# Altium schematic sheet RTM_CON.SchDoc: AMC FMC Carrier v4
size 420 x 297 mm; CompanyName: WUT; Organization: WUT ISE; Address1: Warsaw University of Technology; Address2: Nowowiejska 15/19 00-665 Warsaw; Address3: t.przywozki@gmail.com; Revision: 1; SheetNumber: 20; SheetTotal: 29; Project: AMC FMC Carrier v4.0.2; ModifiedBy: F. Świtakowski; CheckedDate: -; Title2: RTM Connector; DivGrp: ISE; Designer: T. Przywozki; ModifiedDate: -; ProjectName: ADC/DAC MEZZANINE
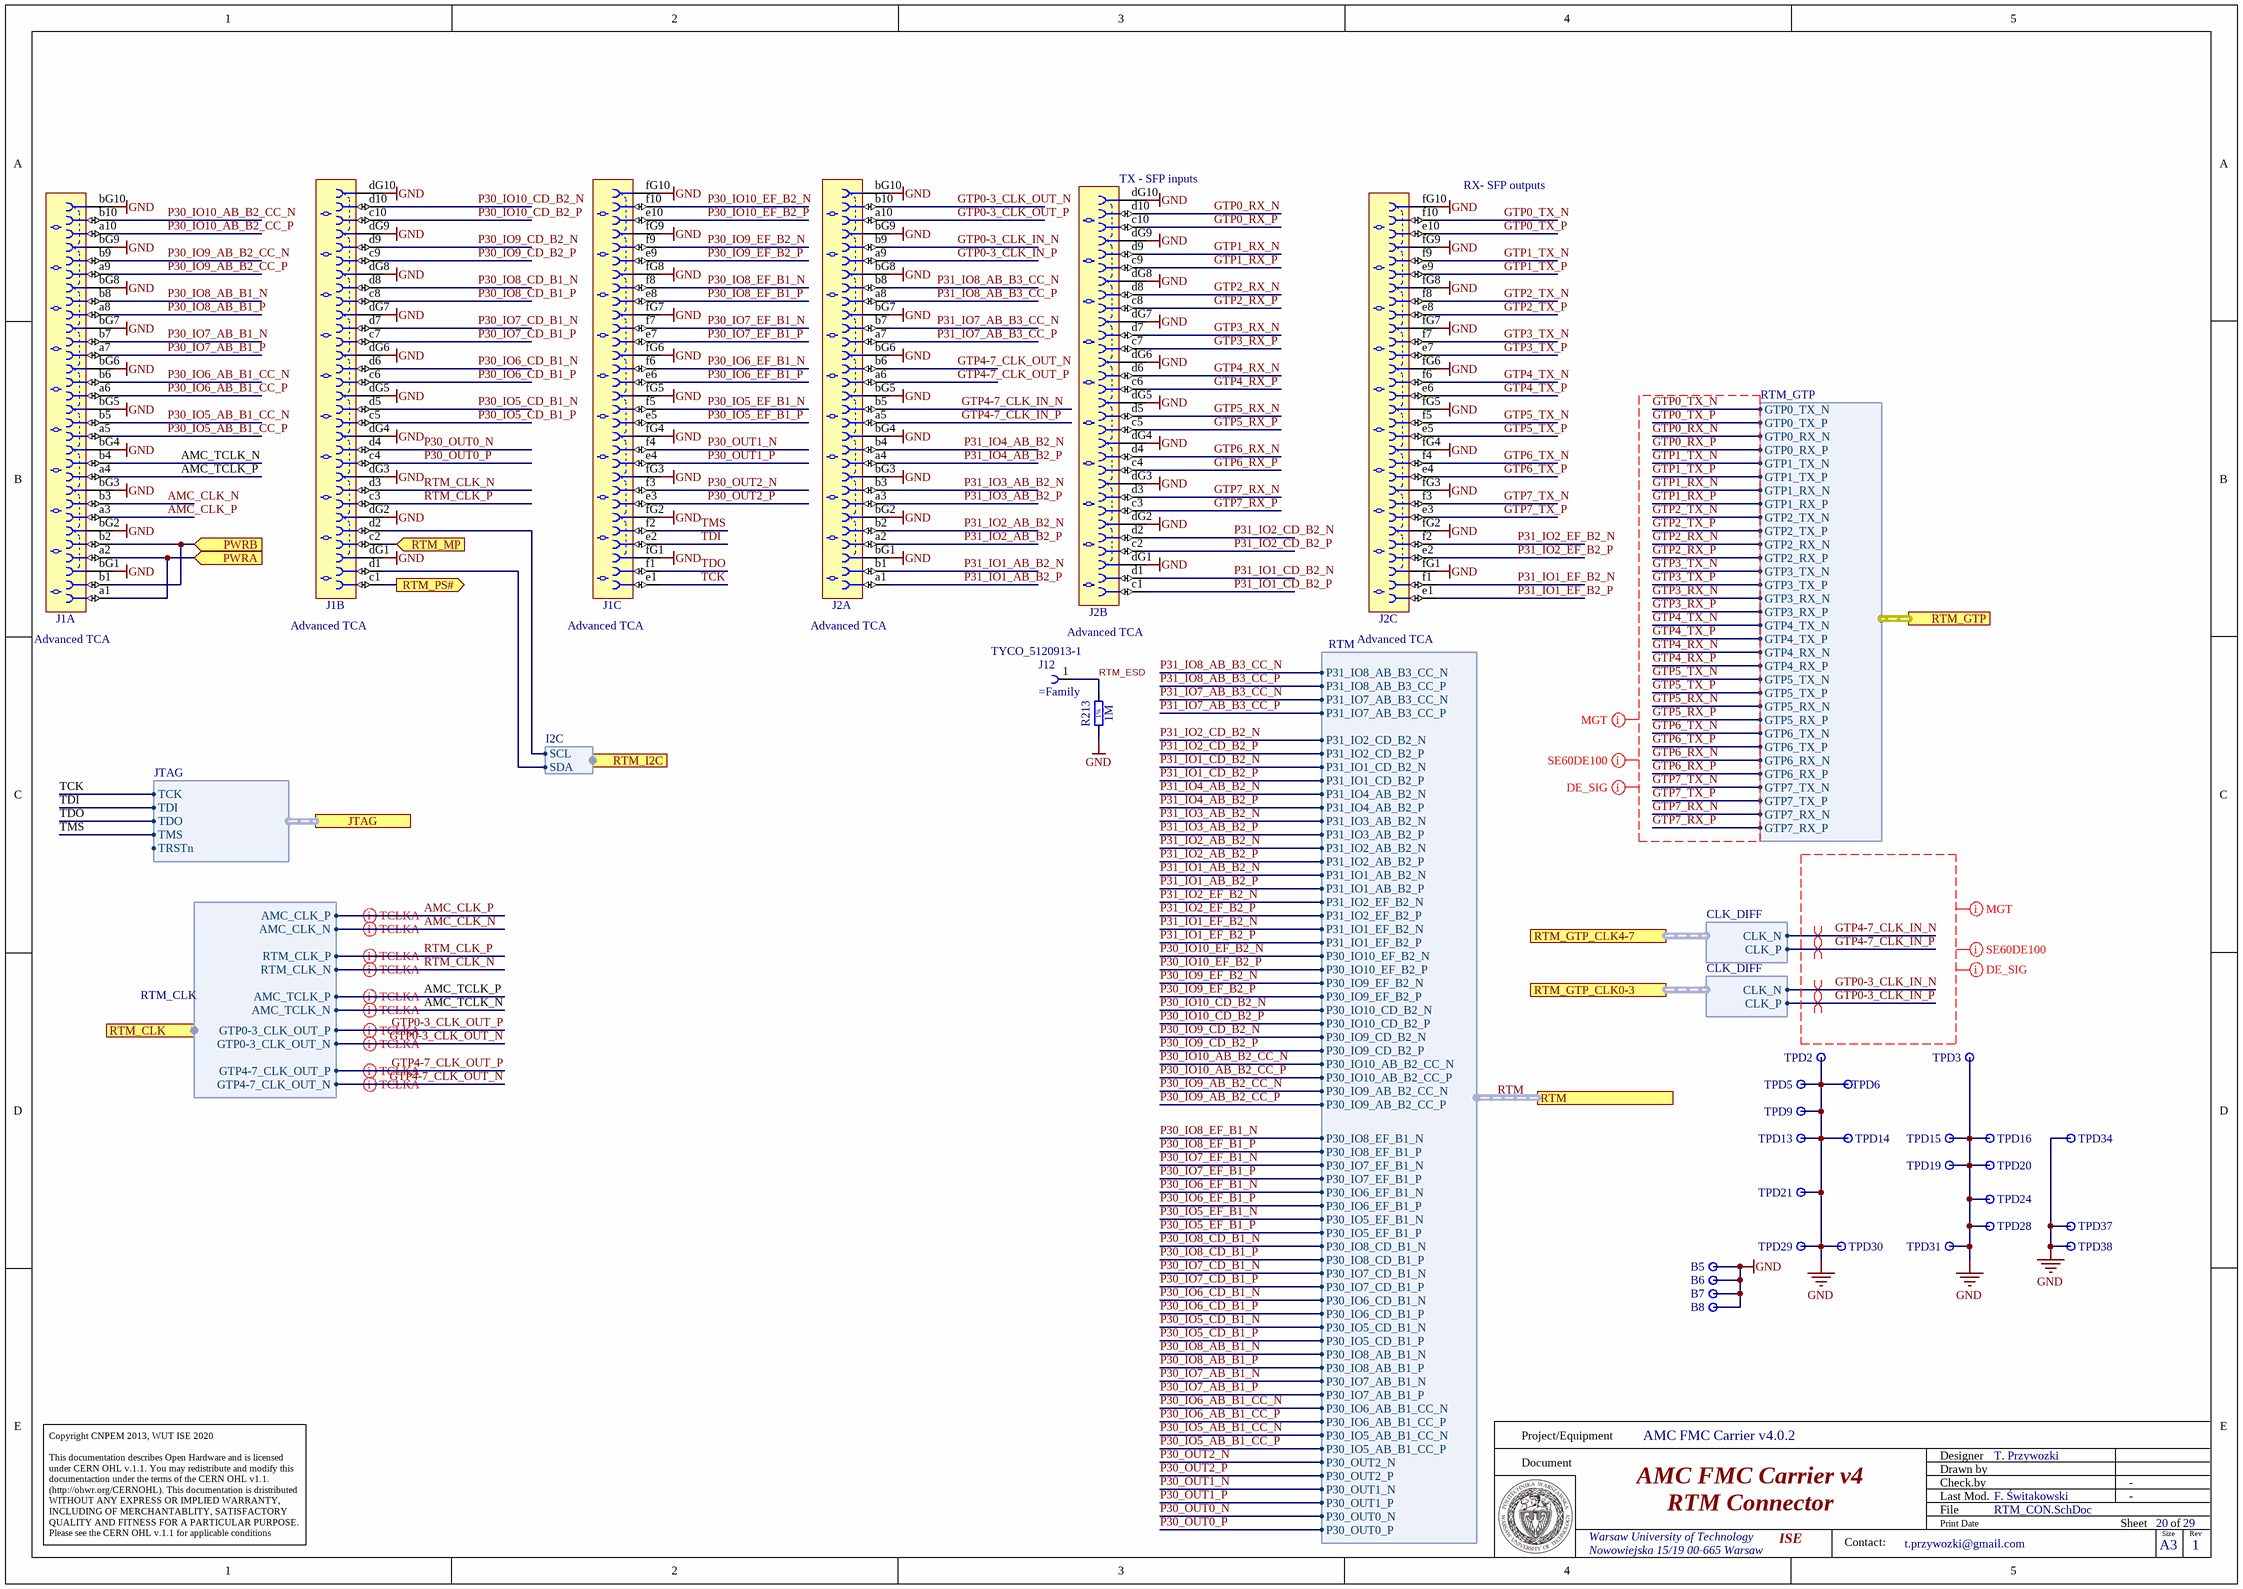
[diagram p0: RTM_CON.SchDoc]

## Parts
B5  Test Point  [VERO_20-2136]  (value not drawn)  (no BOM)
B6  Test Point  [VERO_20-2136]  (value not drawn)  (no BOM)
B7  Test Point  [VERO_20-2136]  (value not drawn)  (no BOM)
B8  Test Point  [VERO_20-2136]  (value not drawn)  (no BOM)
J1  Advanced TCA  [TYCO_6469081-1]  (parts A,B,C of 3)
J2  Advanced TCA  [TYCO_6469081-1]  (parts A,B,C of 3)
J12  (no value)  [TYCO_5120913-1]
R213  1M  [RESC5025X65N]
TPD2  (no value)  [TYCO_RCT-0C]
TPD3  (no value)  [TYCO_RCT-0C]
TPD5  (no value)  [TYCO_RCT-0C]
TPD6  (no value)  [TYCO_RCT-0C]
TPD9  (no value)  [TYCO_RCT-0C]
TPD13  (no value)  [TYCO_RCT-0C]
TPD14  (no value)  [TYCO_RCT-0C]
TPD15  (no value)  [TYCO_RCT-0C]
TPD16  (no value)  [TYCO_RCT-0C]
TPD19  (no value)  [TYCO_RCT-0C]
TPD20  (no value)  [TYCO_RCT-0C]
TPD21  (no value)  [TYCO_RCT-0C]
TPD24  (no value)  [TYCO_RCT-0C]
TPD28  (no value)  [TYCO_RCT-0C]
TPD29  (no value)  [TYCO_RCT-0C]
TPD30  (no value)  [TYCO_RCT-0C]
TPD31  (no value)  [TYCO_RCT-0C]
TPD34  (no value)  [TYCO_RCT-0C]
TPD37  (no value)  [TYCO_RCT-0C]
TPD38  (no value)  [TYCO_RCT-0C]

## Ports
JTAG (harness JTAG), PWRA (in), PWRB (in), RTM (harness RTM), RTM_CLK (harness RTM_CLK), RTM_GTP (harness RTM_GTP), RTM_GTP_CLK0-3 (harness CLK_DIFF), RTM_GTP_CLK4-7 (harness CLK_DIFF), RTM_I2C (harness I2C), RTM_MP (in), RTM_PS# (out)

## Harnesses
RTM_GTP: GTP0_RX_N, GTP0_RX_P, GTP0_TX_N, GTP0_TX_P, GTP1_TX_N, GTP1_TX_P, GTP1_RX_N, GTP1_RX_P, GTP2_TX_N, GTP2_TX_P, GTP2_RX_N, GTP2_RX_P, GTP3_TX_N, GTP3_TX_P, GTP3_RX_N, GTP3_RX_P, GTP4_TX_N, GTP4_TX_P, GTP4_RX_N, GTP4_RX_P, GTP5_TX_N, GTP5_TX_P, GTP5_RX_N, GTP5_RX_P, GTP6_TX_N, GTP6_TX_P, GTP6_RX_N, GTP6_RX_P, GTP7_TX_N, GTP7_TX_P, GTP7_RX_N, GTP7_RX_P
JTAG: TCK, TDI, TDO, TMS, TRSTn
CLK_DIFF: CLK_P, CLK_N
RTM_CLK: GTP0-3_CLK_OUT_P, GTP0-3_CLK_OUT_N, GTP4-7_CLK_OUT_P, GTP4-7_CLK_OUT_N, AMC_TCLK_P, AMC_TCLK_N, RTM_CLK_P, RTM_CLK_N, AMC_CLK_P, AMC_CLK_N
RTM: P31_IO2_CD_B2_N, P31_IO2_CD_B2_P, P31_IO8_AB_B3_CC_N, P31_IO1_CD_B2_N, P31_IO8_AB_B3_CC_P, P31_IO1_CD_B2_P, P31_IO7_AB_B3_CC_N, P31_IO4_AB_B2_N, P31_IO7_AB_B3_CC_P, P31_IO4_AB_B2_P, P30_IO9_AB_B2_CC_P, P30_IO10_CD_B2_P, P30_IO9_CD_B2_N, P30_IO9_CD_B2_P, P30_IO10_AB_B2_CC_N, P30_IO8_EF_B1_N, P30_IO10_AB_B2_CC_P, P30_IO8_EF_B1_P, P30_IO9_AB_B2_CC_N, P30_IO7_EF_B1_N, P30_OUT2_P, P30_OUT2_N, P30_OUT1_N, P30_IO5_AB_B1_CC_P, P30_OUT1_P, P30_IO5_AB_B1_CC_N, P30_OUT0_N, P30_IO6_AB_B1_CC_P, P30_OUT0_P, P30_IO7_CD_B1_P, P30_IO6_CD_B1_N, P30_IO7_EF_B1_P, P30_IO6_CD_B1_P, P30_IO6_EF_B1_N, P30_IO5_CD_B1_N, P30_IO6_EF_B1_P, P30_IO5_CD_B1_P, P30_IO5_EF_B1_N, P30_IO8_AB_B1_N, P30_IO5_EF_B1_P, P30_IO8_AB_B1_P, P30_IO8_CD_B1_N, P30_IO7_AB_B1_N, P30_IO8_CD_B1_P, P30_IO7_AB_B1_P, P30_IO7_CD_B1_N, P30_IO6_AB_B1_CC_N, P31_IO3_AB_B2_N, P31_IO3_AB_B2_P, P31_IO2_AB_B2_N, P31_IO2_AB_B2_P, P31_IO1_AB_B2_N, P31_IO1_AB_B2_P, P31_IO2_EF_B2_N, P31_IO2_EF_B2_P, P31_IO1_EF_B2_N, P31_IO1_EF_B2_P, P30_IO10_EF_B2_N, P30_IO10_EF_B2_P, P30_IO9_EF_B2_N, P30_IO9_EF_B2_P, P30_IO10_CD_B2_N
I2C: SCL, SDA

## Nets
GND: B5.1 B6.1 B7.1 B8.1 J1.bG1 J1.bG2 J1.bG3 J1.bG4 J1.bG5 J1.bG6 J1.bG7 J1.bG8 J1.bG9 J1.bG10 J1.dG1 J1.dG2 J1.dG3 J1.dG4 J1.dG5 J1.dG6 J1.dG7 J1.dG8 J1.dG9 J1.dG10 J1.fG1 J1.fG2 J1.fG3 J1.fG4 J1.fG5 J1.fG6 J1.fG7 J1.fG8 J1.fG9 J1.fG10 J2.bG1 J2.bG2 J2.bG3 J2.bG4 J2.bG5 J2.bG6 J2.bG7 J2.bG8 J2.bG9 J2.bG10 J2.dG1 J2.dG2 J2.dG3 J2.dG4 J2.dG5 J2.dG6 J2.dG7 J2.dG8 J2.dG9 J2.dG10 J2.fG1 J2.fG2 J2.fG3 J2.fG4 J2.fG5 J2.fG6 J2.fG7 J2.fG8 J2.fG9 J2.fG10 R213.1 TPD2.1 TPD3.1 TPD5.1 TPD6.1 TPD9.1 TPD13.1 TPD14.1 TPD15.1 TPD16.1 TPD19.1 TPD20.1 TPD21.1 TPD24.1 TPD28.1 TPD29.1 TPD30.1 TPD31.1 TPD34.1 TPD37.1 TPD38.1
AMC_CLK_N: J1.b3 ; port RTM_CLK.AMC_CLK_N
AMC_CLK_P: J1.a3 ; port RTM_CLK.AMC_CLK_P
AMC_TCLK_N: J1.b4 ; port RTM_CLK.AMC_TCLK_N
AMC_TCLK_P: J1.a4 ; port RTM_CLK.AMC_TCLK_P
GTP0-3_CLK_IN_N: J2.b9 ; port RTM_GTP_CLK0-3.CLK_N
GTP0-3_CLK_IN_P: J2.a9 ; port RTM_GTP_CLK0-3.CLK_P
GTP0-3_CLK_OUT_N: J2.b10 ; port RTM_CLK.GTP0-3_CLK_OUT_N
GTP0-3_CLK_OUT_P: J2.a10 ; port RTM_CLK.GTP0-3_CLK_OUT_P
GTP0_RX_N: J2.d10 ; port RTM_GTP.GTP0_RX_N
GTP0_RX_P: J2.c10 ; port RTM_GTP.GTP0_RX_P
GTP0_TX_N: J2.f10 ; port RTM_GTP.GTP0_TX_N
GTP0_TX_P: J2.e10 ; port RTM_GTP.GTP0_TX_P
GTP1_RX_N: J2.d9 ; port RTM_GTP.GTP1_RX_N
GTP1_RX_P: J2.c9 ; port RTM_GTP.GTP1_RX_P
GTP1_TX_N: J2.f9 ; port RTM_GTP.GTP1_TX_N
GTP1_TX_P: J2.e9 ; port RTM_GTP.GTP1_TX_P
GTP2_RX_N: J2.d8 ; port RTM_GTP.GTP2_RX_N
GTP2_RX_P: J2.c8 ; port RTM_GTP.GTP2_RX_P
GTP2_TX_N: J2.f8 ; port RTM_GTP.GTP2_TX_N
GTP2_TX_P: J2.e8 ; port RTM_GTP.GTP2_TX_P
GTP3_RX_N: J2.d7 ; port RTM_GTP.GTP3_RX_N
GTP3_RX_P: J2.c7 ; port RTM_GTP.GTP3_RX_P
GTP3_TX_N: J2.f7 ; port RTM_GTP.GTP3_TX_N
GTP3_TX_P: J2.e7 ; port RTM_GTP.GTP3_TX_P
GTP4-7_CLK_IN_N: J2.b5 ; port RTM_GTP_CLK4-7.CLK_N
GTP4-7_CLK_IN_P: J2.a5 ; port RTM_GTP_CLK4-7.CLK_P
GTP4-7_CLK_OUT_N: J2.b6 ; port RTM_CLK.GTP4-7_CLK_OUT_N
GTP4-7_CLK_OUT_P: J2.a6 ; port RTM_CLK.GTP4-7_CLK_OUT_P
GTP4_RX_N: J2.d6 ; port RTM_GTP.GTP4_RX_N
GTP4_RX_P: J2.c6 ; port RTM_GTP.GTP4_RX_P
GTP4_TX_N: J2.f6 ; port RTM_GTP.GTP4_TX_N
GTP4_TX_P: J2.e6 ; port RTM_GTP.GTP4_TX_P
GTP5_RX_N: J2.d5 ; port RTM_GTP.GTP5_RX_N
GTP5_RX_P: J2.c5 ; port RTM_GTP.GTP5_RX_P
GTP5_TX_N: J2.f5 ; port RTM_GTP.GTP5_TX_N
GTP5_TX_P: J2.e5 ; port RTM_GTP.GTP5_TX_P
GTP6_RX_N: J2.d4 ; port RTM_GTP.GTP6_RX_N
GTP6_RX_P: J2.c4 ; port RTM_GTP.GTP6_RX_P
GTP6_TX_N: J2.f4 ; port RTM_GTP.GTP6_TX_N
GTP6_TX_P: J2.e4 ; port RTM_GTP.GTP6_TX_P
GTP7_RX_N: J2.d3 ; port RTM_GTP.GTP7_RX_N
GTP7_RX_P: J2.c3 ; port RTM_GTP.GTP7_RX_P
GTP7_TX_N: J2.f3 ; port RTM_GTP.GTP7_TX_N
GTP7_TX_P: J2.e3 ; port RTM_GTP.GTP7_TX_P
P30_IO5_AB_B1_CC_N: J1.b5 ; port RTM.P30_IO5_AB_B1_CC_N
P30_IO5_AB_B1_CC_P: J1.a5 ; port RTM.P30_IO5_AB_B1_CC_P
P30_IO5_CD_B1_N: J1.d5 ; port RTM.P30_IO5_CD_B1_N
P30_IO5_CD_B1_P: J1.c5 ; port RTM.P30_IO5_CD_B1_P
P30_IO5_EF_B1_N: J1.f5 ; port RTM.P30_IO5_EF_B1_N
P30_IO5_EF_B1_P: J1.e5 ; port RTM.P30_IO5_EF_B1_P
P30_IO6_AB_B1_CC_N: J1.b6 ; port RTM.P30_IO6_AB_B1_CC_N
P30_IO6_AB_B1_CC_P: J1.a6 ; port RTM.P30_IO6_AB_B1_CC_P
P30_IO6_CD_B1_N: J1.d6 ; port RTM.P30_IO6_CD_B1_N
P30_IO6_CD_B1_P: J1.c6 ; port RTM.P30_IO6_CD_B1_P
P30_IO6_EF_B1_N: J1.f6 ; port RTM.P30_IO6_EF_B1_N
P30_IO6_EF_B1_P: J1.e6 ; port RTM.P30_IO6_EF_B1_P
P30_IO7_AB_B1_N: J1.b7 ; port RTM.P30_IO7_AB_B1_N
P30_IO7_AB_B1_P: J1.a7 ; port RTM.P30_IO7_AB_B1_P
P30_IO7_CD_B1_N: J1.d7 ; port RTM.P30_IO7_CD_B1_N
P30_IO7_CD_B1_P: J1.c7 ; port RTM.P30_IO7_CD_B1_P
P30_IO7_EF_B1_N: J1.f7 ; port RTM.P30_IO7_EF_B1_N
P30_IO7_EF_B1_P: J1.e7 ; port RTM.P30_IO7_EF_B1_P
P30_IO8_AB_B1_N: J1.b8 ; port RTM.P30_IO8_AB_B1_N
P30_IO8_AB_B1_P: J1.a8 ; port RTM.P30_IO8_AB_B1_P
P30_IO8_CD_B1_N: J1.d8 ; port RTM.P30_IO8_CD_B1_N
P30_IO8_CD_B1_P: J1.c8 ; port RTM.P30_IO8_CD_B1_P
P30_IO8_EF_B1_N: J1.f8 ; port RTM.P30_IO8_EF_B1_N
P30_IO8_EF_B1_P: J1.e8 ; port RTM.P30_IO8_EF_B1_P
P30_IO9_AB_B2_CC_N: J1.b9 ; port RTM.P30_IO9_AB_B2_CC_N
P30_IO9_AB_B2_CC_P: J1.a9 ; port RTM.P30_IO9_AB_B2_CC_P
P30_IO9_CD_B2_N: J1.d9 ; port RTM.P30_IO9_CD_B2_N
P30_IO9_CD_B2_P: J1.c9 ; port RTM.P30_IO9_CD_B2_P
P30_IO9_EF_B2_N: J1.f9 ; port RTM.P30_IO9_EF_B2_N
P30_IO9_EF_B2_P: J1.e9 ; port RTM.P30_IO9_EF_B2_P
P30_IO10_AB_B2_CC_N: J1.b10 ; port RTM.P30_IO10_AB_B2_CC_N
P30_IO10_AB_B2_CC_P: J1.a10 ; port RTM.P30_IO10_AB_B2_CC_P
P30_IO10_CD_B2_N: J1.d10 ; port RTM.P30_IO10_CD_B2_N
P30_IO10_CD_B2_P: J1.c10 ; port RTM.P30_IO10_CD_B2_P
P30_IO10_EF_B2_N: J1.f10 ; port RTM.P30_IO10_EF_B2_N
P30_IO10_EF_B2_P: J1.e10 ; port RTM.P30_IO10_EF_B2_P
P30_OUT0_N: J1.d4 ; port RTM.P30_OUT0_N
P30_OUT0_P: J1.c4 ; port RTM.P30_OUT0_P
P30_OUT1_N: J1.f4 ; port RTM.P30_OUT1_N
P30_OUT1_P: J1.e4 ; port RTM.P30_OUT1_P
P30_OUT2_N: J1.f3 ; port RTM.P30_OUT2_N
P30_OUT2_P: J1.e3 ; port RTM.P30_OUT2_P
P31_IO1_AB_B2_N: J2.b1 ; port RTM.P31_IO1_AB_B2_N
P31_IO1_AB_B2_P: J2.a1 ; port RTM.P31_IO1_AB_B2_P
P31_IO1_CD_B2_N: J2.d1 ; port RTM.P31_IO1_CD_B2_N
P31_IO1_CD_B2_P: J2.c1 ; port RTM.P31_IO1_CD_B2_P
P31_IO1_EF_B2_N: J2.f1 ; port RTM.P31_IO1_EF_B2_N
P31_IO1_EF_B2_P: J2.e1 ; port RTM.P31_IO1_EF_B2_P
P31_IO2_AB_B2_N: J2.b2 ; port RTM.P31_IO2_AB_B2_N
P31_IO2_AB_B2_P: J2.a2 ; port RTM.P31_IO2_AB_B2_P
P31_IO2_CD_B2_N: J2.d2 ; port RTM.P31_IO2_CD_B2_N
P31_IO2_CD_B2_P: J2.c2 ; port RTM.P31_IO2_CD_B2_P
P31_IO2_EF_B2_N: J2.f2 ; port RTM.P31_IO2_EF_B2_N
P31_IO2_EF_B2_P: J2.e2 ; port RTM.P31_IO2_EF_B2_P
P31_IO3_AB_B2_N: J2.b3 ; port RTM.P31_IO3_AB_B2_N
P31_IO3_AB_B2_P: J2.a3 ; port RTM.P31_IO3_AB_B2_P
P31_IO4_AB_B2_N: J2.b4 ; port RTM.P31_IO4_AB_B2_N
P31_IO4_AB_B2_P: J2.a4 ; port RTM.P31_IO4_AB_B2_P
P31_IO7_AB_B3_CC_N: J2.b7 ; port RTM.P31_IO7_AB_B3_CC_N
P31_IO7_AB_B3_CC_P: J2.a7 ; port RTM.P31_IO7_AB_B3_CC_P
P31_IO8_AB_B3_CC_N: J2.b8 ; port RTM.P31_IO8_AB_B3_CC_N
P31_IO8_AB_B3_CC_P: J2.a8 ; port RTM.P31_IO8_AB_B3_CC_P
PWRA: J1.a1 J1.a2 ; port PWRA
PWRB: J1.b1 J1.b2 ; port PWRB
RTM_CLK_N: J1.d3 ; port RTM_CLK.RTM_CLK_N
RTM_CLK_P: J1.c3 ; port RTM_CLK.RTM_CLK_P
RTM_ESD: J12.1 R213.2
RTM_MP: J1.c2 ; port RTM_MP
RTM_PS#: J1.c1 ; port RTM_PS#
TCK: J1.e1 ; port JTAG.TCK
TDI: J1.e2 ; port JTAG.TDI
TDO: J1.f1 ; port JTAG.TDO
TMS: J1.f2 ; port JTAG.TMS
NetJ1_d1: J1.d1 ; port RTM_I2C.SDA
NetJ1_d2: J1.d2 ; port RTM_I2C.SCL

## Buses and harness runs
harness RTM = port RTM

## Layout directives
net class SE60DE100: GTP0-3_CLK_IN_N, GTP0-3_CLK_IN_P, GTP0_RX_N, GTP0_RX_P, GTP0_TX_N, GTP0_TX_P, GTP1_RX_N, GTP1_RX_P, GTP1_TX_N, GTP1_TX_P, GTP2_RX_N, GTP2_RX_P, GTP2_TX_N, GTP2_TX_P, GTP3_RX_N, GTP3_RX_P, GTP3_TX_N, GTP3_TX_P, GTP4-7_CLK_IN_N, GTP4-7_CLK_IN_P, GTP4_RX_N, GTP4_RX_P, GTP4_TX_N, GTP4_TX_P, GTP5_RX_N, GTP5_RX_P, GTP5_TX_N, GTP5_TX_P, GTP6_RX_N, GTP6_RX_P, GTP6_TX_N, GTP6_TX_P, GTP7_RX_N, GTP7_RX_P, GTP7_TX_N, GTP7_TX_P
net class DE_SIG: GTP0-3_CLK_IN_N, GTP0-3_CLK_IN_P, GTP0_RX_N, GTP0_RX_P, GTP0_TX_N, GTP0_TX_P, GTP1_RX_N, GTP1_RX_P, GTP1_TX_N, GTP1_TX_P, GTP2_RX_N, GTP2_RX_P, GTP2_TX_N, GTP2_TX_P, GTP3_RX_N, GTP3_RX_P, GTP3_TX_N, GTP3_TX_P, GTP4-7_CLK_IN_N, GTP4-7_CLK_IN_P, GTP4_RX_N, GTP4_RX_P, GTP4_TX_N, GTP4_TX_P, GTP5_RX_N, GTP5_RX_P, GTP5_TX_N, GTP5_TX_P, GTP6_RX_N, GTP6_RX_P, GTP6_TX_N, GTP6_TX_P, GTP7_RX_N, GTP7_RX_P, GTP7_TX_N, GTP7_TX_P
differential pair: AMC_CLK_N, AMC_CLK_P, AMC_TCLK_N, AMC_TCLK_P, GTP0-3_CLK_IN_N, GTP0-3_CLK_IN_P, GTP0-3_CLK_OUT_N, GTP0-3_CLK_OUT_P, GTP4-7_CLK_IN_N, GTP4-7_CLK_IN_P, GTP4-7_CLK_OUT_N, GTP4-7_CLK_OUT_P, RTM_CLK_N, RTM_CLK_P
net class MGT: GTP0-3_CLK_IN_N, GTP0-3_CLK_IN_P, GTP0_RX_N, GTP0_RX_P, GTP0_TX_N, GTP0_TX_P, GTP1_RX_N, GTP1_RX_P, GTP1_TX_N, GTP1_TX_P, GTP2_RX_N, GTP2_RX_P, GTP2_TX_N, GTP2_TX_P, GTP3_RX_N, GTP3_RX_P, GTP3_TX_N, GTP3_TX_P, GTP4-7_CLK_IN_N, GTP4-7_CLK_IN_P, GTP4_RX_N, GTP4_RX_P, GTP4_TX_N, GTP4_TX_P, GTP5_RX_N, GTP5_RX_P, GTP5_TX_N, GTP5_TX_P, GTP6_RX_N, GTP6_RX_P, GTP6_TX_N, GTP6_TX_P, GTP7_RX_N, GTP7_RX_P, GTP7_TX_N, GTP7_TX_P

## Notes on the sheet
- (near J2) TX - SFP inputs
- RX- SFP outputs
- Project/Equipment
- Document
- Designer
- Drawn by
- Check.by
- Copyright CNPEM 2013, WUT ISE 2020
  This documentation describes Open Hardware and is licensed under CERN OHL v.1.1. You may redistribute and modify this documentaction under the terms of the CERN OHL v1.1.
  (http://ohwr.org/CERNOHL). This documentation is dristributed WITHOUT ANY EXPRESS OR IMPLIED WARRANTY, INCLUDING OF MERCHANTABLITY, SATISFACTORY QUALITY AND FITNESS FOR A PARTICULAR PURPOSE. Please see the CERN OHL v.1.1 for applicable conditions
- File
- Last Mod.
- Print Date
- Sheet
- Size
- A3
- of
- Rev
- Contact:
- (in symbol R2010_1M_1%_0.5W_200PPM) 1%

## Library data of the parts
B5-B8 = VERO_20-2136: Single Terminal Socket; Part Description: Black Bead PCB Terminal Test Pin (1.32 mm hole); Manufacturer: VERO TECHNOLOGIES; Table: Miscellaneous; Part Number: VERO_20-2136; Component Type: Standard; Pin Count: 1; Family: Test Point; Mounted: Yes; Socket: No; SMD: No; Status: None; Manufacturer Part Number: 20-2136; ComponentHeight: 5.3mm; HelpURL: \\cern.ch\dfs\Applications\Altium\Datasheets\VERO_20-2136.pdf; Author: CERN DEM JLC; CreateDate: 21/07/2008; LatestRevisionDate: 21/07/2008
J1 J2 = TYCO_6469081-1: Connector 60 ATCA Female 30 Pairs (60 Signals) + 3x10 Ground; Part Description: 60 Positions, Pitch 2.5mm,  Advanced TCA, Z-PACK HM-Zd Right Angle Press Fit Receptacle; Manufacturer: TYCO ELECTRONICS; Table: TYCO; Part Number: TYCO_6469081-1; Component Kind: Standard; Component Type: Standard; Pin Count: 90; Family: Advanced TCA; Mounted: Yes; Socket: No; SMD: No; Status: None; Manufacturer Part Number: 6469081-1; ComponentHeight: 12.18mm; HelpURL: \\cern.ch\dfs\Applications\Altium\Datasheets\TYCO_6469081-1.pdf; Author: CERN DEM JLC; CreateDate: 2013-08-28; LatestRevisionDate: 2013-08-28
J12 = TYCO_5120913-1: Single Pin Female; Manufacturer: TYCO ELECTRONICS; Part Description: Universal Right Angle Female Power Module Guide (keyed); PressFit: No; Manufacturer Part Number: 5120913-1; Part Number: TYCO_5120913-1; Component Kind: Standard; Component Type: Standard; Pin Count: 1; Mounted: Yes; Socket: No; SMD: No; Sense: No; Status: None; ComponentHeight: 9.78mm; HelpURL: \\cern.ch\dfs\Applications\Altium\Datasheets\TYCO_5120913-1.pdf; Author: CERN DEM JLC; CreateDate: 28.08.2013; LatestRevisionDate: 28.08.2013
R213 = R2010_1M_1%_0.5W_200PPM: Resistor - 1%; Manufacturer: GENERIC; Part Description: Thick Film Chip Resistor; Manufacturer1 Part Number: LHVC2010-1MFT4; Power: 0.5W; TC: ±200ppm/°C; PressFit: No; Manufacturer Part Number: R2010_1M_1%_0.5W_200PPM; Part Number: R2010_1M_1%_0.5W_200PPM; Tolerance: ±1%; Value: 1M; Component Kind: Standard; Component Type: Standard; Pin Count: 2; Status: None; Case: 2010; Mounted: Yes; Sense: No; Socket: No; SMD: Yes; Manufacturer1 Example: TT WELWYN; Manufacturer1 ComponentHeight: 0.65mm; HelpURL: \\cern.ch\dfs\Applications\Altium\Datasheets\R2010_WELWYN_LHVC.pdf; Author: CERN DEM JLC; CreateDate: 26.02.2015; LatestRevisionDate: 26.02.2015
TPD2 TPD3 TPD5 TPD6 TPD9 TPD13-TPD16 TPD19-TPD21 TPD24 TPD28-TPD31 TPD34 TPD37 TPD38 = TYCO_RCT-0C: Test Point; Part Description: 0805 (2012) Surface Mount Test Point; Manufacturer: TYCO ELECTRONICS; Manufacturer Part Number: RCT-0C; PressFit: No; Part Number: TYCO_RCT-0C; Component Kind: Standard; Component Type: Standard; Pin Count: 1; Mounted: Yes; Socket: No; SMD: Yes; Sense: No; Status: None; ComponentHeight: 1.45mm; HelpURL: \\cern.ch\dfs\Applications\Altium\Datasheets\TYCO_RCT-0C.pdf; Author: CERN DEM JLC; CreateDate: 07.05.2014; LatestRevisionDate: 07.05.2014